# Altium schematic sheet top.SchDoc
size A
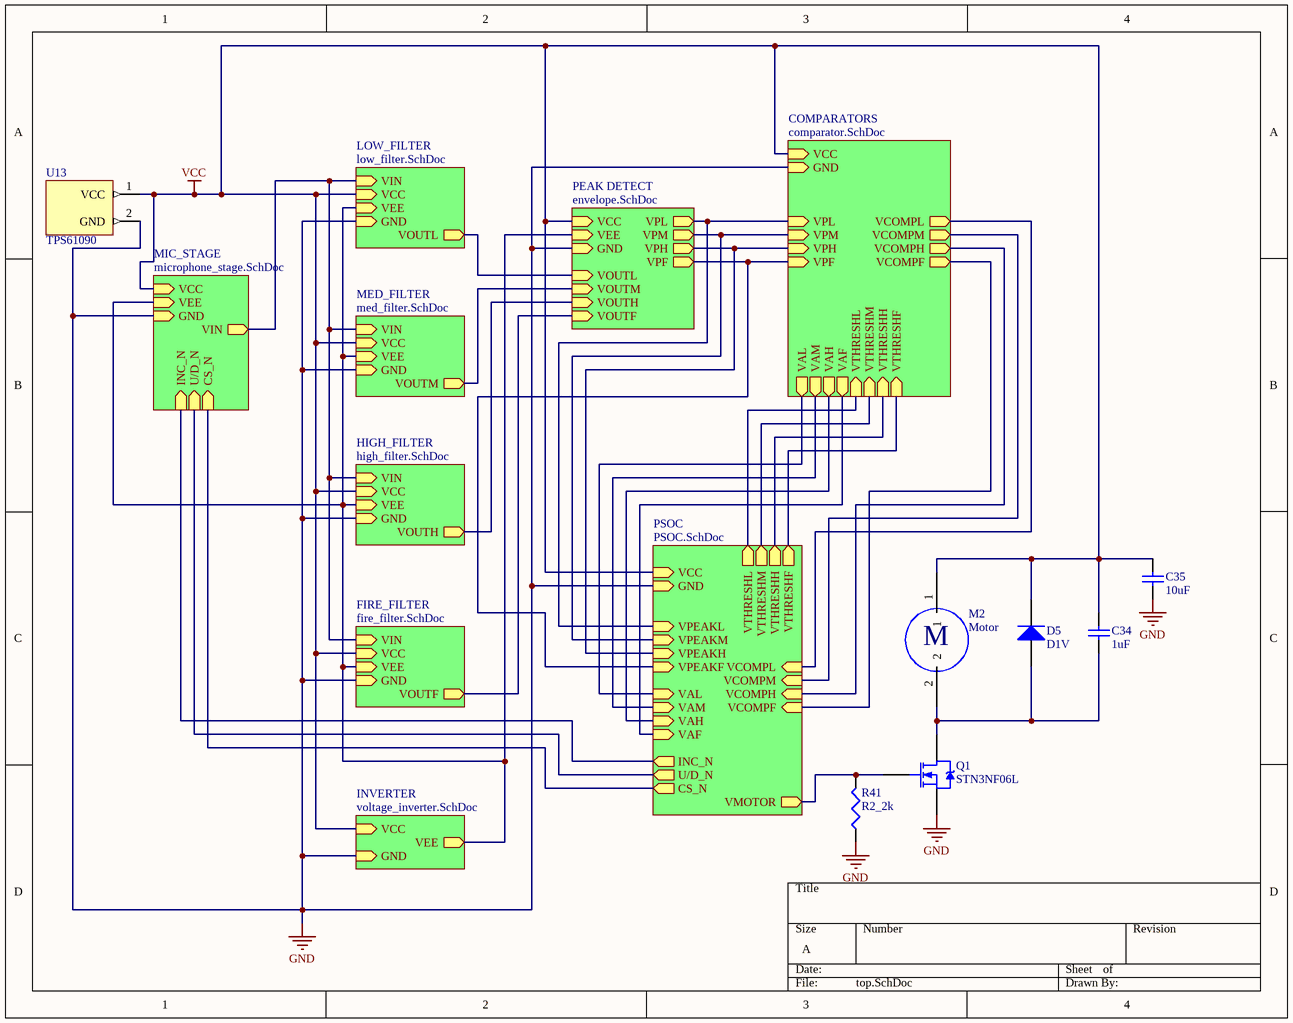
[diagram p0: top.SchDoc]

## Parts
C34  1uF  [C0603]
C35  10uF  [C0603]
D5  D1V  [D1206]
M2  Motor  [B2B-PH-K-S]
Q1  STN3NF06L  [SOT-223]
R41  R2_2k  [R0603]
U13  TPS61090  [B2B-PH-K-S]

## Sub-sheets
COMPARATORS = comparator.SchDoc: VCC (in), VTHRESHL (in), VTHRESHM (in), VTHRESHH (in), GND (in), VTHRESHF (in), VAL (out), VAM (out), VAH (out), VAF (out), VPL (in), VPM (in), VPH (in), VPF (in), VCOMPL (out), VCOMPM (out), VCOMPH (out), VCOMPF (out)
FIRE_FILTER = fire_filter.SchDoc: GND (in), VEE (in), VIN (in), VCC (in), VOUTF (out)
HIGH_FILTER = high_filter.SchDoc: GND (in), VEE (in), VIN (in), VCC (in), VOUTH (out)
INVERTER = voltage_inverter.SchDoc: VCC (in), VEE (out), GND (in)
LOW_FILTER = low_filter.SchDoc: VIN (in), VCC (in), VOUTL (out), VEE (in), GND (in)
MED_FILTER = med_filter.SchDoc: GND (in), VCC (in), VEE (in), VIN (in), VOUTM (out)
MIC_STAGE = microphone_stage.SchDoc: VIN (out), VCC (in), GND (in), VEE (in), U/D_N (in), INC_N (in), CS_N (in)
PEAK DETECT = envelope.SchDoc: VCC (in), VPL (out), VPH (out), VPM (out), VPF (out), GND (in), VEE (in), VOUTL (in), VOUTM (in), VOUTF (in), VOUTH (in)
PSOC = PSOC.SchDoc: VCC (in), VTHRESHL (out), VTHRESHM (out), VTHRESHH (out), VTHRESHF (out), VAL (in), VAM (in), VAH (in), VAF (in), VMOTOR (out), GND (in), VCOMPL (in), VCOMPM (in), VCOMPH (in), VCOMPF (in), INC_N (out), U/D_N (out), CS_N (out), VPEAKL (in), VPEAKM (in), VPEAKH (in), VPEAKF (in)

## Nets
GND: C35.1 Q1.3(S) R41.1 U13.2(GND) ; sheet LOW_FILTER/GND, sheet MED_FILTER/GND, sheet HIGH_FILTER/GND, sheet FIRE_FILTER/GND, sheet INVERTER/GND, sheet COMPARATORS/GND, sheet MIC_STAGE/GND, sheet PEAK DETECT/GND, sheet PSOC/GND
VCC: C34.2 C35.2 D5.2(K) M2.1 U13.1(VCC) ; sheet LOW_FILTER/VCC, sheet MED_FILTER/VCC, sheet HIGH_FILTER/VCC, sheet FIRE_FILTER/VCC, sheet INVERTER/VCC, sheet COMPARATORS/VCC, sheet MIC_STAGE/VCC, sheet PEAK DETECT/VCC, sheet PSOC/VCC
NetC34_1: C34.1 D5.1(A) M2.2 Q1.2(D)
NetQ1_1: Q1.1(G) R41.2 ; sheet PSOC/VMOTOR
(unnamed): sheet LOW_FILTER/VIN, sheet MED_FILTER/VIN, sheet HIGH_FILTER/VIN, sheet FIRE_FILTER/VIN, sheet MIC_STAGE/VIN
(unnamed): sheet LOW_FILTER/VOUTL, sheet PEAK DETECT/VOUTL
(unnamed): sheet LOW_FILTER/VEE, sheet MED_FILTER/VEE, sheet HIGH_FILTER/VEE, sheet FIRE_FILTER/VEE, sheet INVERTER/VEE, sheet MIC_STAGE/VEE, sheet PEAK DETECT/VEE
(unnamed): sheet MED_FILTER/VOUTM, sheet PEAK DETECT/VOUTM
(unnamed): sheet HIGH_FILTER/VOUTH, sheet PEAK DETECT/VOUTH
(unnamed): sheet FIRE_FILTER/VOUTF, sheet PEAK DETECT/VOUTF
(unnamed): sheet COMPARATORS/VTHRESHL, sheet PSOC/VTHRESHL
(unnamed): sheet COMPARATORS/VTHRESHM, sheet PSOC/VTHRESHM
(unnamed): sheet COMPARATORS/VTHRESHH, sheet PSOC/VTHRESHH
(unnamed): sheet COMPARATORS/VTHRESHF, sheet PSOC/VTHRESHF
(unnamed): sheet COMPARATORS/VAL, sheet PSOC/VAL
(unnamed): sheet COMPARATORS/VAM, sheet PSOC/VAM
(unnamed): sheet COMPARATORS/VAH, sheet PSOC/VAH
(unnamed): sheet COMPARATORS/VAF, sheet PSOC/VAF
(unnamed): sheet COMPARATORS/VPL, sheet PEAK DETECT/VPL, sheet PSOC/VPEAKL
(unnamed): sheet COMPARATORS/VPM, sheet PEAK DETECT/VPM, sheet PSOC/VPEAKM
(unnamed): sheet COMPARATORS/VPH, sheet PEAK DETECT/VPH, sheet PSOC/VPEAKH
(unnamed): sheet COMPARATORS/VPF, sheet PEAK DETECT/VPF, sheet PSOC/VPEAKF
(unnamed): sheet COMPARATORS/VCOMPL, sheet PSOC/VCOMPL
(unnamed): sheet COMPARATORS/VCOMPM, sheet PSOC/VCOMPM
(unnamed): sheet COMPARATORS/VCOMPH, sheet PSOC/VCOMPH
(unnamed): sheet COMPARATORS/VCOMPF, sheet PSOC/VCOMPF
(unnamed): sheet MIC_STAGE/U/D_N, sheet PSOC/U/D_N
(unnamed): sheet MIC_STAGE/INC_N, sheet PSOC/INC_N
(unnamed): sheet MIC_STAGE/CS_N, sheet PSOC/CS_N

## Notes on the sheet
- (in symbol Motor) M

## Library data of the parts
C34 = C1uF: 1 uF Surface Mount Capacitor; Manufacturer: Murata Electronics North America; Manufacturer Part Number: GRM188R61C105KA93D; Capacitance: 1µF; Tolerance: ±10%; Voltage - Rated: 16V; Temperature Coefficient: X5R; Supplier 1: Digi-Key; RoHS: RoHS Compliant; Category: Capacitors; Stock 1: 1349645; Pricing 1: 1=0.1, 10=0.034, 50=0.0182, 100=0.0154, 250=0.0126, 500=0.01078, 1000=0.0084 (USD); Packaging: Digi-Reel®; Part Status: Active; Operating Temperature: -55°C ~ 85°C; Features: -; Ratings: -; Applications: General Purpose; Mounting Type: Surface Mount, MLCC; Package / Case: 0603 (1608 Metric); Size / Dimension: 0.063" L x 0.031" W (1.60mm x 0.80mm); Height - Seated (Max): -; Thickness (Max): 0.035" (0.90mm); Lead Spacing: -; Lead Style: -; ComponentLink1URL: http://www.murata.com/~/media/webrenewal/support/library/catalog/products/capacitor/mlcc/c02e.pdf; ComponentLink1Description: http://www.murata.com/~/media/webrenewal/support/library/catalog/products/capacitor/mlcc/c02e.pdf; Supplier Part Number 1: 490-1536-6-ND
C35 = C10uF: 10 uF Surface Mount Capacitor; Manufacturer: Yageo; Manufacturer Part Number: CC0603KRX5R5BB106; Capacitance: 10µF; Tolerance: ±10%; Voltage - Rated: 6.3V; Temperature Coefficient: X5R; Supplier 1: Digi-Key; RoHS: RoHS Compliant; Category: Capacitors; Stock 1: 18386; Pricing 1: 1=0.27, 10=0.186, 25=0.1488, 50=0.124, 100=0.1054, 250=0.08368, 500=0.0744, 1000=0.06509 (USD); Packaging: Digi-Reel®; Part Status: Active; Operating Temperature: -55°C ~ 85°C; Features: -; Ratings: -; Applications: General Purpose; Failure Rate: -; Mounting Type: Surface Mount, MLCC; Package / Case: 0603 (1608 Metric); Size / Dimension: 0.063" L x 0.031" W (1.60mm x 0.80mm); Height - Seated (Max): -; Thickness (Max): 0.035" (0.90mm); Lead Spacing: -; Lead Style: -; ComponentLink1URL: http://www.yageo.com/documents/recent/UPY-GPHC_X5R_4V-to-50V_23.pdf; ComponentLink1Description: http://www.yageo.com/documents/recent/UPY-GPHC_X5R_4V-to-50V_23.pdf; Supplier Part Number 1: 311-1781-6-ND
D5 = D1V: Standard 1V Diode; Manufacturer: Bourns Inc.; Manufacturer Part Number: CD1206-S01575; Voltage - DC Reverse (Vr) (Max): 100V; Current - Average Rectified (Io): 150mA; Voltage - Forward (Vf) (Max) @ If: 1V @ 50mA; Speed: Small Signal =< 200mA (Io), Any Speed; Reverse Recovery Time (trr): 4ns; Current - Reverse Leakage @ Vr: 2.5µA @ 100V; Capacitance @ Vr, F: 3pF @ 0V, 100MHz; Supplier 1: Digi-Key; RoHS: RoHS Compliant; Category: Discrete Semiconductor Products; Stock 1: 122779; Pricing 1: 1=0.15, 10=0.142, 25=0.1288, 100=0.0927, 250=0.0546, 500=0.04532, 1000=0.0309, 2500=0.02626 (USD); Packaging: Cut Tape (CT); Part Status: Active; Diode Type: Standard; Mounting Type: Surface Mount; Package / Case: 1206 (3216 Metric); Supplier Device Package: 1206; Operating Temperature - Junction: -55°C ~ 125°C; ComponentLink1URL: http://www.bourns.com/docs/Product-Datasheets/CD1206_S01575.pdf; ComponentLink1Description: http://www.bourns.com/docs/Product-Datasheets/CD1206_S01575.pdf; Supplier Part Number 1: CD1206-S01575CT-ND
M2 = Motor: Manufacturer: JST Sales America Inc.; Manufacturer Part Number: B2B-PH-K-S(LF)(SN); Connector Type: Header, Shrouded; Number of Positions: 2; Number of Positions Loaded: All; Pitch: 0.079" (2.00mm); Supplier 1: Digi-Key; RoHS: RoHS Compliant; Category: Connectors, Interconnects; Stock 1: 349866; Pricing 1: 1=0.17, 10=0.162, 100=0.1002, 500=0.08288, 1000=0.07252, 5000=0.06216, 10000=0.06044 (USD); Packaging: Bulk; Part Status: Active; Contact Type: Male Pin; Number of Rows: 1; Row Spacing: -; Contact Mating Length: 0.130" (3.30mm); Mounting Type: Through Hole; Termination: Press-Fit, Solder; Fastening Type: Detent Lock; Features: -; Contact Finish: Tin; Contact Finish Thickness: -; Color: Natural; ComponentLink1URL: http://www.jst-mfg.com/product/pdf/eng/ePH.pdf; ComponentLink1Description: http://www.jst-mfg.com/product/pdf/eng/ePH.pdf; Supplier Part Number 1: 455-1704-ND
Q1 = STN3NF06L: N-Channel 4A Power MOSFET; Manufacturer: STMicroelectronics; Drain to Source Voltage (Vdss): 60V; Current - Continuous Drain (Id) @ 25°C: 4A (Tc); Drive Voltage (Max Rds On,  Min Rds On): 5V, 10V; Vgs(th) (Max) @ Id: 2.8V @ 250µA; Gate Charge (Qg) (Max) @ Vgs: 9nC @ 5V; Input Capacitance (Ciss) (Max) @ Vds: 340pF @ 25V; Vgs (Max): ±16V; Power Dissipation (Max): 3.3W (Tc); Rds On (Max) @ Id, Vgs: 100 mOhm @ 1.5A, 10V; Supplier 1: Digi-Key; Manufacturer Part Number: STN3NF06L; RoHS: RoHS Compliant; Category: Discrete Semiconductor Products; Stock 1: 8902; Pricing 1: 1=0.63, 10=0.541, 100=0.4038, 500=0.31724, 1000=0.24514 (USD); Packaging: Digi-Reel®; Part Status: Active; FET Type: N-Channel; Technology: MOSFET (Metal Oxide); FET Feature: -; Operating Temperature: -55°C ~ 150°C (TJ); Mounting Type: Surface Mount; Supplier Device Package: SOT-223; Package / Case: TO-261-4, TO-261AA; ComponentLink1URL: http://www.st.com/content/ccc/resource/technical/document/datasheet/b1/52/93/f0/a9/a9/40/d7/CD00002430.pdf/files/CD00002430.pdf/jcr:content/translations/en.CD00002430.pdf; ComponentLink1Description: http://www.st.com/content/ccc/resource/technical/document/datasheet/b1/52/93/f0/a9/a9/40/d7/CD00002430.pdf/files/CD00002430.pdf/jcr:content/translations/en.CD00002430.pdf; Supplier Part Number 1: 497-3177-6-ND
R41 = R2_2k: 2.2k Ohms Surface Mount Resistor; Manufacturer: Yageo; Manufacturer Part Number: RC0603FR-072K2L; Tolerance: ±1%; Power (Watts): 0.1W, 1/10W; Temperature Coefficient: ±100ppm/°C; Supplier 1: Digi-Key; RoHS: RoHS Compliant; Category: Resistors; Stock 1: 4524664; Pricing 1: 1=0.1, 10=0.013, 25=0.0092, 50=0.007, 100=0.0052, 250=0.00396, 500=0.00316, 1000=0.00233 (USD); Packaging: Digi-Reel®; Part Status: Active; Resistance (Ohms): 2.2k; Composition: Thick Film; Features: Moisture Resistant; Operating Temperature: -55°C ~ 155°C; Package / Case: 0603 (1608 Metric); Supplier Device Package: 0603; Size / Dimension: 0.063" L x 0.031" W (1.60mm x 0.80mm); Height - Seated (Max): 0.022" (0.55mm); Number of Terminations: 2; Failure Rate: -; ComponentLink1URL: http://www.yageo.com/NewPortal/yageodocoutput?fileName=/pdf/R-Chip/PYu-RC_Group_51_RoHS_L_4.pdf; ComponentLink1Description: http://www.yageo.com/NewPortal/yageodocoutput?fileName=/pdf/R-Chip/PYu-RC_Group_51_RoHS_L_4.pdf; Supplier Part Number 1: 311-2.20KHRDKR-ND
U13 = TPS61090: Power Electronics Connector; Manufacturer: JST Sales America Inc.; Manufacturer Part Number: B2B-PH-K-S(LF)(SN); Connector Type: Header; Pitch - Mating: 0.079" (2.00mm); Shrouding: Shrouded - 4 Wall; Number of Positions: 2; Number of Positions Loaded: All; Contact Length - Mating: 0.130" (3.30mm); Supplier 1: Digi-Key; RoHS: RoHS Compliant; Category: Connectors, Interconnects; Stock 1: 327416; Pricing 1: 1=0.17, 10=0.162, 100=0.1002, 500=0.08288, 1000=0.07252, 5000=0.06216, 10000=0.06044 (USD); Packaging: Bulk; Part Status: Active; Contact Type: Male Pin; Number of Rows: 1; Row Spacing - Mating: -; Mounting Type: Through Hole; Termination: Press-Fit, Solder; Fastening Type: Detent Lock; Features: -; Contact Finish - Mating: Tin; Contact Finish Thickness - Mating: -; Insulation Color: Natural; Ingress Protection: -; ComponentLink1URL: http://www.jst-mfg.com/product/pdf/eng/ePH.pdf; ComponentLink1Description: http://www.jst-mfg.com/product/pdf/eng/ePH.pdf; Supplier Part Number 1: 455-1704-ND